# EAGLE schematic Receiver (EAGLE 7.7.0)
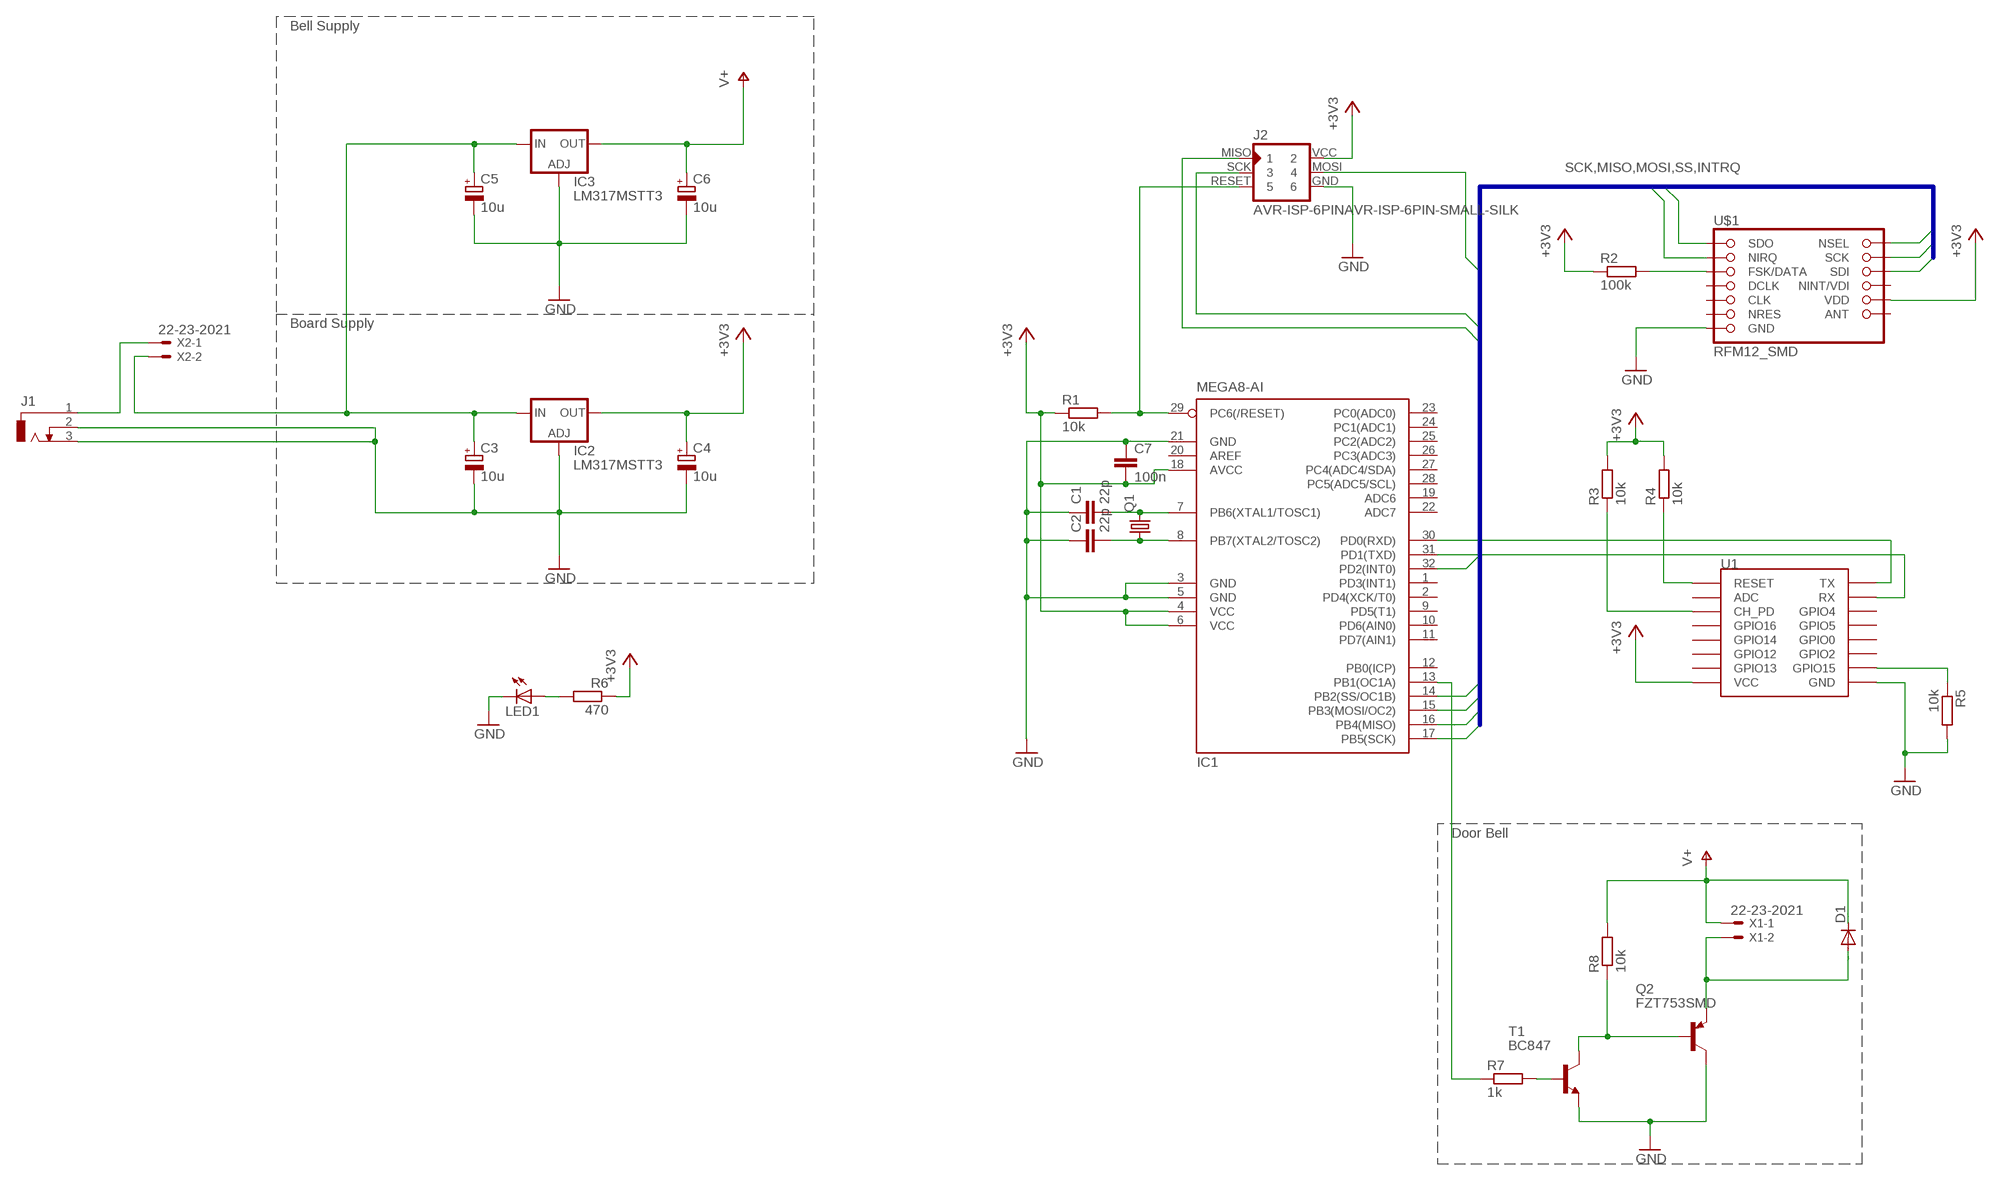
[diagram p0: schematic, sheet 1]

## Parts
C1  22p  C-EUC0603  [C0603]
C2  22p  C-EUC0603  [C0603]
C3  10u  CPOL-EUE1.8-4  [E1,8-4]
C4  10u  CPOL-EUE1.8-4  [E1,8-4]
C5  10u  CPOL-EUE1.8-4  [E1,8-4]
C6  10u  CPOL-EUE1.8-4  [E1,8-4]
C7  100n  C-EUC0603  [C0603]
D1  DIODE-DO-214AC  [DO-214AC]
IC1  MEGA8-AI  [TQFP32-08]
IC2  LM317MSTT3  [SOT223]
IC3  LM317MSTT3  [SOT223]
J1  DCJ0303  [DCJ0303]
J2  AVR-ISP-6PINAVR-ISP-6PIN-SMALL-SILK  [AVR-ISP-6PIN-SMAILL-SILK]
LED1  LED3MM  [LED3MM]
Q1  CRYSTALHC49S  [HC49/S]
Q2  FZT753SMD  [SOT223]
R1  10k  R-EU_R0603  [R0603]
R2  100k  R-EU_R0603  [R0603]
R3  10k  R-EU_R0603  [R0603]
R4  10k  R-EU_R0603  [R0603]
R5  10k  R-EU_R0603  [R0603]
R6  470  R-EU_R0603  [R0603]
R7  1k  R-EU_R0603  [R0603]
R8  10k  R-EU_R0603  [R0603]
T1  BC847  [SOT23]
U1  ESP12SMD  [ESP12-SMD]
U$1  RFM12_SMD  [RFM12_SMD]
X1  22-23-2021  [22-23-2021]
X2  22-23-2021  [22-23-2021]

## Nets
+3V3: C4.+ C7.2 IC1.4(VCC) IC1.6(VCC) IC1.18(AVCC) IC2.4(OUT) J2.VCC R1.1 R2.1 R3.2 R4.2 R6.1 U1.VCC U$1.9(VDD)
GND: C1.1 C2.1 C3.- C4.- C5.- C6.- C7.1 IC1.3(GND) IC1.5(GND) IC1.21(GND) IC2.1(ADJ) IC3.1(ADJ) J1.2 J1.3 J2.GND LED1.K(C) Q2.2(C) Q2.4(C) R5.2 T1.2(E) U1.GND U$1.7(GND) U$1.10(GND)
INTRQ: IC1.32(PD2(INT0)) U$1.2(NIRQ)
MISO: IC1.16(PB4(MISO)) J2.MISO U$1.1(SDO)
MOSI: IC1.15(PB3(MOSI/OC2)) J2.MOSI U$1.12(SDI)
N$1: IC1.29(PC6(/RESET)) J2.RESET R1.2
N$2: C1.2 IC1.7(PB6(XTAL1/TOSC1)) Q1.2
N$3: C2.2 IC1.8(PB7(XTAL2/TOSC2)) Q1.1
N$4: C3.+ C5.+ IC2.3(IN) IC3.3(IN) X2.2
N$5: R2.2 U$1.3(FSK/DATA)
N$6: J1.1 X2.1
N$7: LED1.A R6.2
N$9: R4.1 U1.RESET
N$10: R3.1 U1.CH_PD
N$11: R5.1 U1.GPIO15
N$12: D1.A Q2.3(E) X1.2
N$16: IC1.13(PB1(OC1A)) R7.1
N$17: R7.2 T1.1(B)
N$18: Q2.1(B) R8.1 T1.3(C)
RX: IC1.30(PD0(RXD)) U1.TXD0(TX)
SCK: IC1.17(PB5(SCK)) J2.SCK U$1.13(SCK)
SS: IC1.14(PB2(SS/OC1B)) U$1.14(NSEL)
TX: IC1.31(PD1(TXD)) U1.RXD0(RX)
V+: C6.+ D1.C IC3.4(OUT) R8.2 X1.1
Unconnected: IC1.1(PD3(INT1)) IC1.2(PD4(XCK/T0)) IC1.9(PD5(T1)) IC1.10(PD6(AIN0)) IC1.11(PD7(AIN1)) IC1.12(PB0(ICP)) IC1.19(ADC6) IC1.20(AREF) IC1.22(ADC7) IC1.23(PC0(ADC0)) IC1.24(PC1(ADC1)) IC1.25(PC2(ADC2)) IC1.26(PC3(ADC3)) IC1.27(PC4(ADC4/SDA)) IC1.28(PC5(ADC5/SCL)) U1.ADC U1.GPIO0 U1.GPIO2 U1.GPIO4 U1.GPIO5 U1.GPIO12 U1.GPIO13 U1.GPIO14 U1.GPIO16 U$1.4(DCLK) U$1.5(CLK) U$1.6(NRES) U$1.8(ANT) U$1.11(NINT/VDI)

## Buses
SCK,MISO,MOSI,SS,INTRQ

## Notes on the sheet
- Bell Supply
- Board Supply
- Door Bell

## Library data of the parts
C1 C2 C7 = rcl:C-EU: CAPACITOR, European symbol
C3-C6 = rcl:CPOL-EU: POLARIZED CAPACITOR, European symbol
D1 = diode:DIODE-: DIODE
IC1 = atmel:MEGA8: MICROCONTROLLER 8 Kbytes FLASH, 1 kbytes SRAM, 512 bytes EEPROM, USART, 6-channel 10 bit ADC, 2-channel 8 bit ADC Pin compatible with Atmega48, ATMega88, ATMega168 Source: avr.lbr; MPN: ATMEGA8-16AU; OC_FARNELL: 9171371; OC_NEWARK: 73M8863
IC2 IC3 = v-reg:LM317?*: 500 mA Adjustable Output Positive Voltage Regulator Source: http://www.onsemi.co.jp .. LM317M-D.PDF
J1 = con-jack:DCJ0303: DC POWER JACK Source: DCJ0303.pdf; OC_FARNELL: unknown; OC_NEWARK: unknown
J2 = avr-isp:AVR-ISP-6PIN: AVR ISP 6pin 3x2 pin header
LED1 = led:LED: LED OSRAM: - CHIPLED LG R971, LG N971, LY N971, LG Q971, LY Q971, LO R971, LY R971 LH N974, LH R974 LS Q976, LO Q976, LY Q976 LO Q996 - Hyper CHIPLED LW Q18S LB Q993, LB Q99A, LB R99A - SideLED LS A670, LO A670, LY A670, LG A670, LP A670 LB A673, LV A673, LT A673, LW A673 LH A674 LY A675 LS A676, LA A676, LO A676, LY A676, LW A676 LS A679, LY A679, LG A679 - Hyper Micro SIDELED® LS Y876, LA Y876, LO Y876, LY Y876 LT Y87S - SmartLED LW L88C, LW L88S LB L89C, LB L89S, LG L890 LS L89K, LO L89K, LY L89K LS L896, LA L896, LO L896, LY L896 - TOPLED LS T670, LO T670, LY T670, LG T670, LP T670 LSG T670, LSP T670, LSY T670, LOP T670, LYG T670 LG T671, LOG T671, LSG T671 LB T673, LV T673, LT T673, LW T673 LH T674 LS T676, LA T676, LO T676, LY T676, LB T676, LH T676, LSB T676, LW T676 LB T67C, LV T67C, LT T67C, LS T67K, LO T67K, LY T67K, LW E67C LS E67B, LA E67B, LO E67B, LY E67B, LB E67C, LV E67C, LT E67C LW T67C LS T679, LY T679, LG T679 LS T770, LO T770, LY T770, LG T770, LP T770 LB T773, LV T773, LT T773, LW T773 LH T774 LS E675, LA E675, LY E675, LS T675 LS T776, LA T776, LO T776, LY T776, LB T776 LHGB T686 LT T68C, LB T68C - Hyper Mini TOPLED® LB M676 - Mini TOPLED Santana® LG M470 LS M47K, LO M47K, LY M47K Source: http://www.osram.convergy.de LUXEON: - LUMILED® LXK2-PW12-R00, LXK2-PW12-S00, LXK2-PW14-U00, LXK2-PW14-V00 LXK2-PM12-R00, LXK2-PM12-S00, LXK2-PM14-U00 LXK2-PE12-Q00, LXK2-PE12-R00, LXK2-PE12-S00, LXK2-PE14-T00, LXK2-PE14-U00 LXK2-PB12-K00, LXK2-PB12-L00, LXK2-PB12-M00, LXK2-PB14-N00, LXK2-PB14-P00, LXK2-PB14-Q00 LXK2-PR12-L00, LXK2-PR12-M00, LXK2-PR14-Q00, LXK2-PR14-R00 LXK2-PD12-Q00, LXK2-PD12-R00, LXK2-PD12-S00 LXK2-PH12-R00, LXK2-PH12-S00 LXK2-PL12-P00, LXK2-PL12-Q00, LXK2-PL12-R00 Source: www.luxeon.com KINGBRIGHT: KA-3528ASYC Source: www.kingbright.com
Q1 = crystal:CRYSTAL: CRYSTAL; OC_FARNELL: 1667008; OC_NEWARK: unknown
Q2 = transistor-pnp:FZT753SMD: PNP Transistor
R1-R8 = rcl:R-EU_: RESISTOR, European symbol
T1 = transistor:BC847: NPN TRANSISTOR
U1 = esp8266modules:ESP12: ESP8266 Wifi module 12
U$1 = RFM:RFM12_SMD
X1 X2 = con-molex:22-23-2021: .100" (2.54mm) Center Header - 2 Pin; MF: MOLEX; MPN: 22-23-2021; OC_FARNELL: 1462926; OC_NEWARK: 25C3832